# Altium schematic sheet PowerBoard.SchDoc
size A2
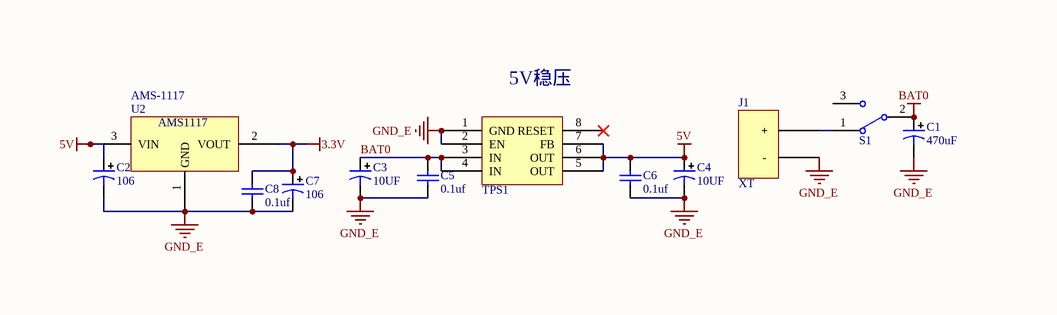
[diagram p0: PowerBoard.SchDoc, top left]
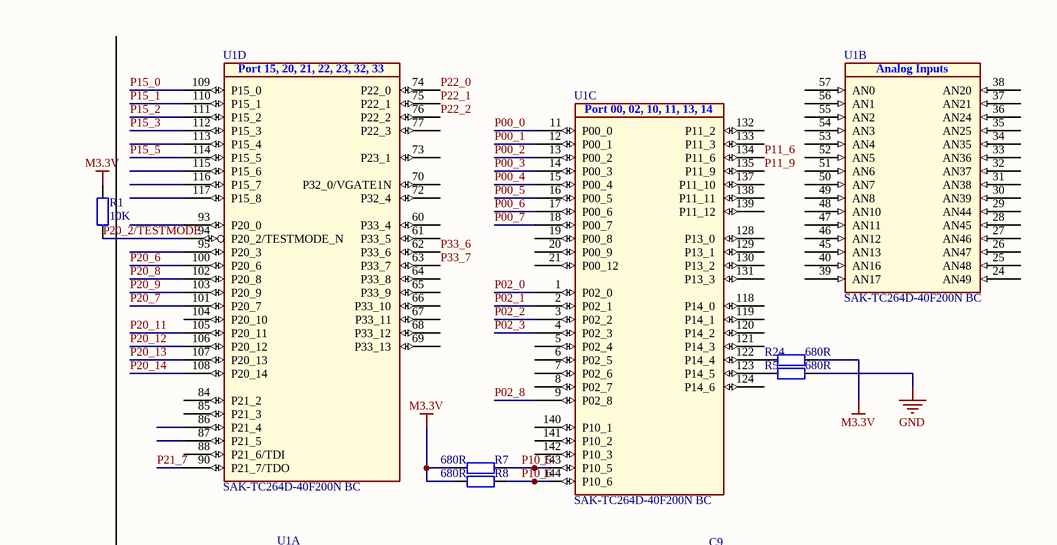
[diagram p1: PowerBoard.SchDoc, top right]
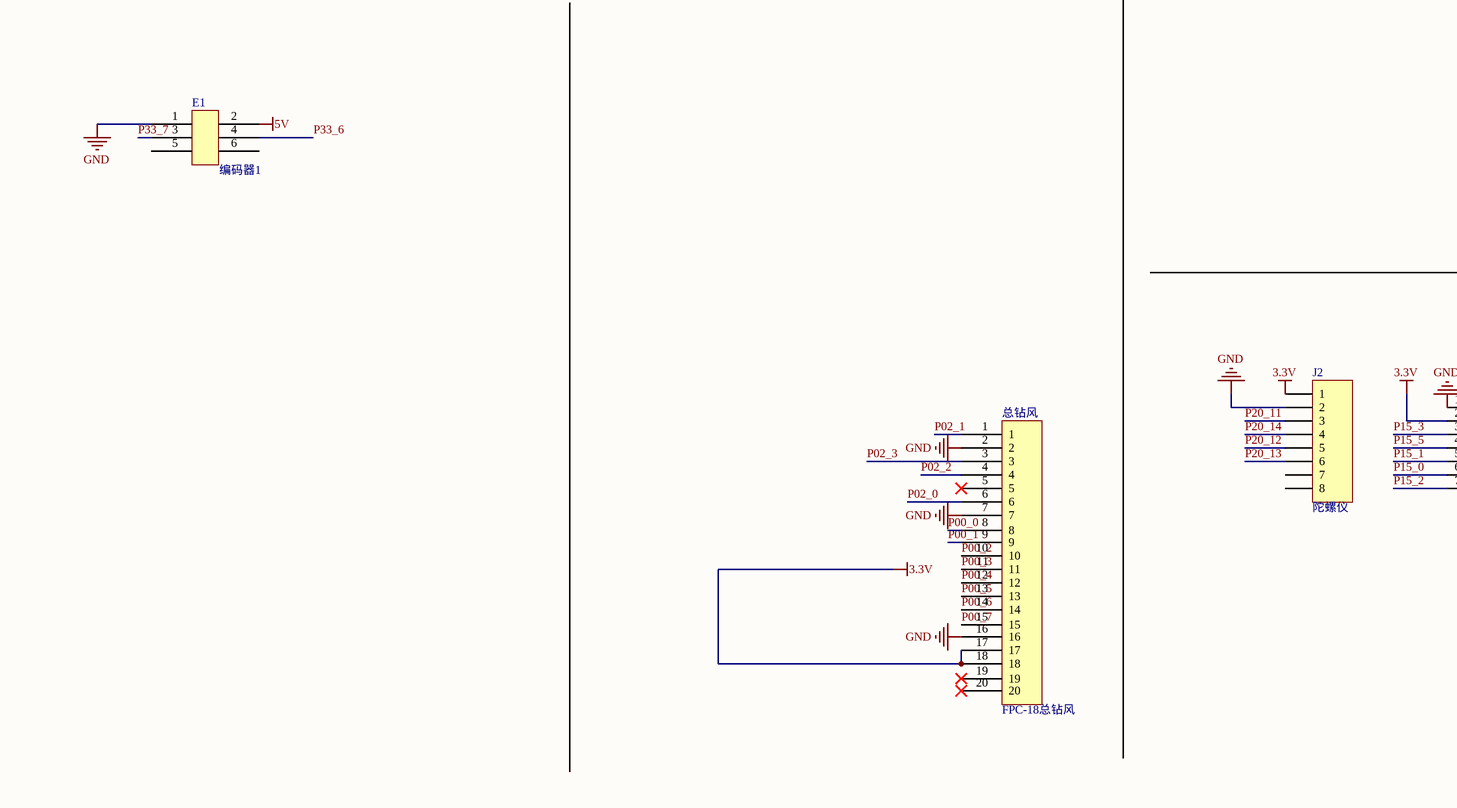
[diagram p2: PowerBoard.SchDoc, bottom left]
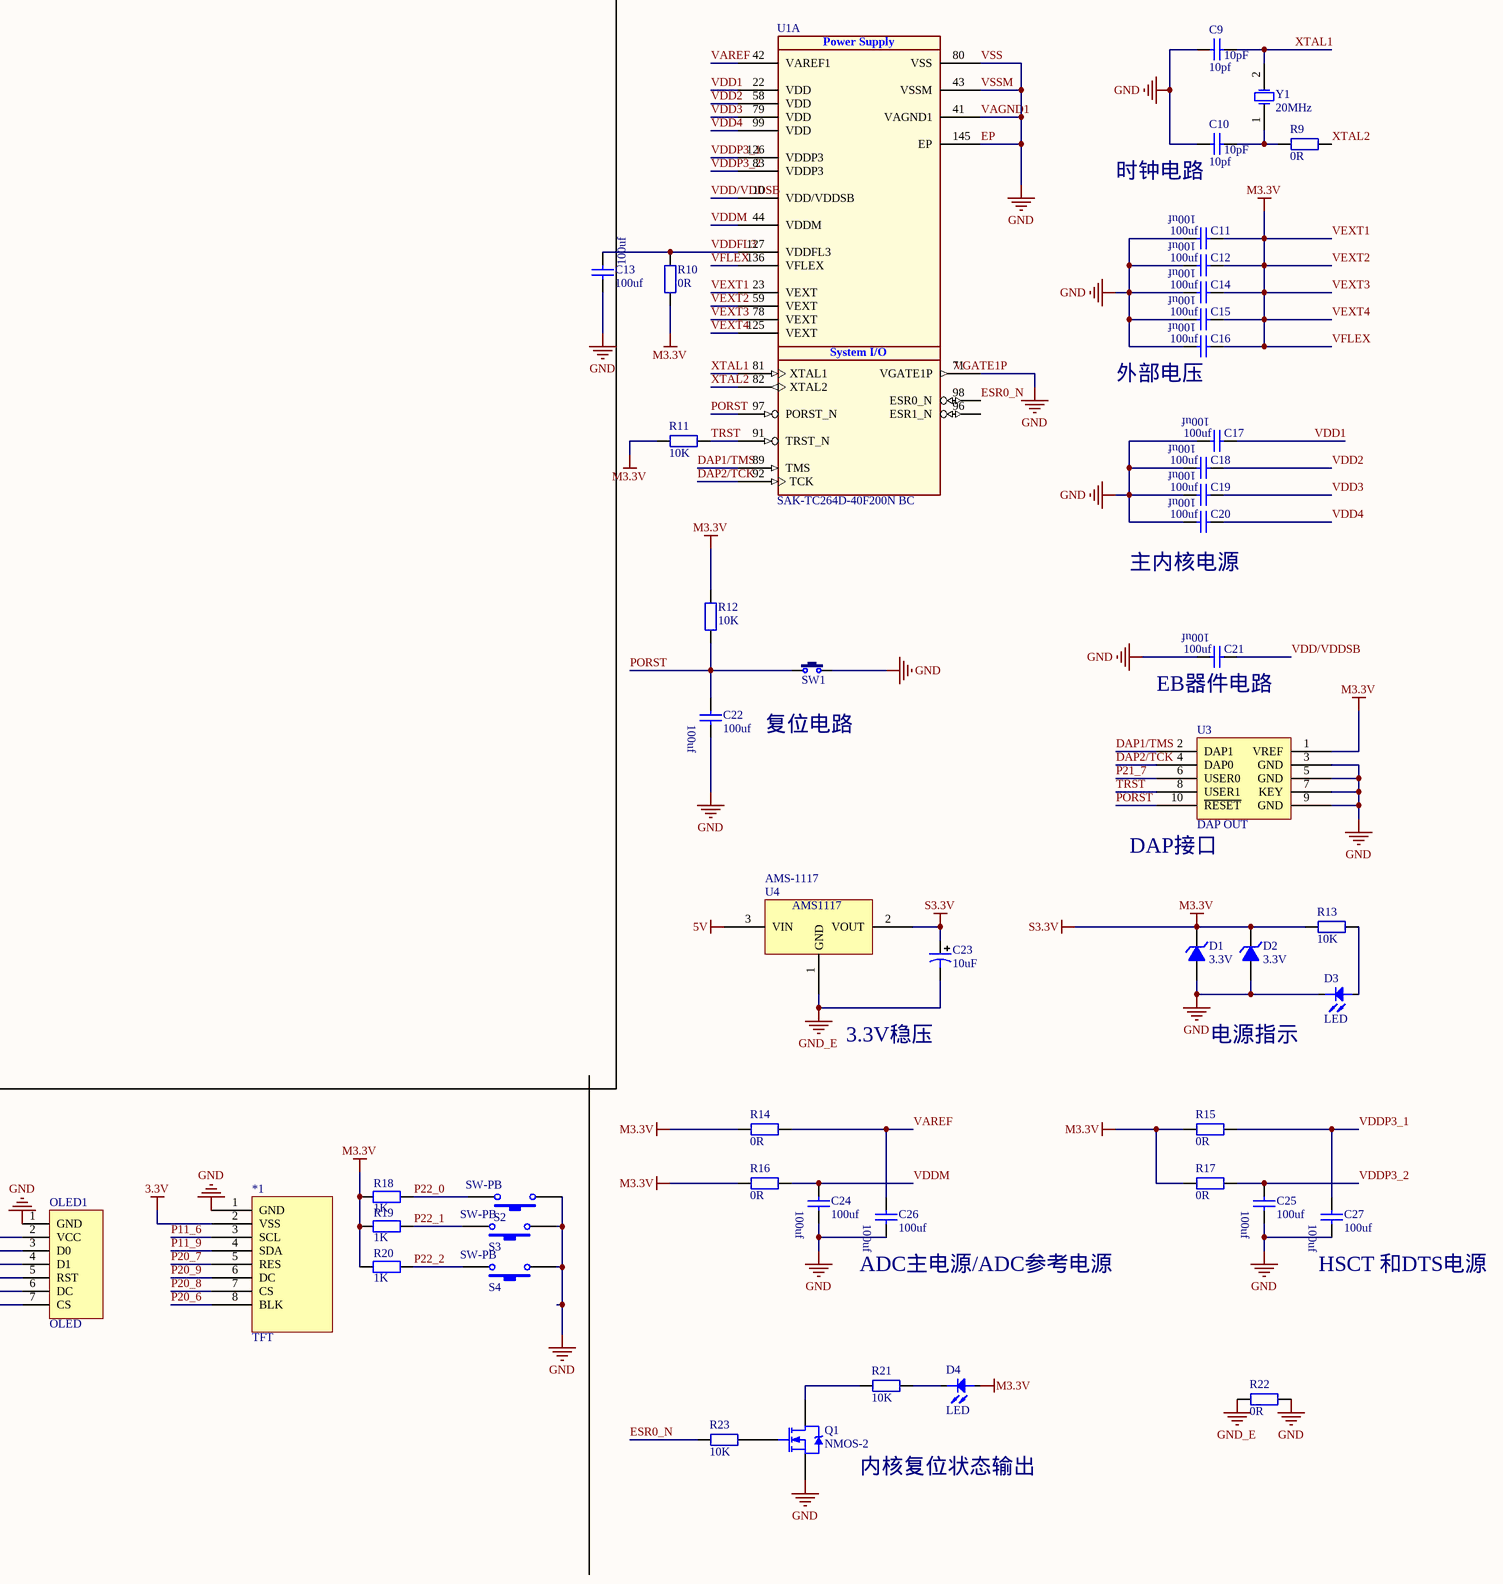
[diagram p3: PowerBoard.SchDoc, bottom right]

## Parts
*1  TFT  [1.8TFT彩屏]
C1  470uf  [CM E(8*10.2)]
C2  value 106  [1206]  (hidden comment: 10uf)
C3  10uf  [1206]
C4  10uf  [1206]
C5  0.1uf  [0805C]
C6  0.1uf  [0805C]
C7  value 106  [1206]  (hidden comment: 10uf)
C8  0.1uf  [0805C]
C9  10pf  [0805C]
C10  10pf  [0805C]
C11  100uf  [0805C]
C12  100uf  [0805C]
C13  100uf  [0805C]
C14  100uf  [0805C]
C15  100uf  [0805C]
C16  100uf  [0805C]
C17  100uf  [0805C]
C18  100uf  [0805C]
C19  100uf  [0805C]
C20  100uf  [0805C]
C21  100uf  [0805C]
C22  100uf  [0805C]
C23  10uf  [CM E(8*10.2)]
C24  100uf  [0805C]
C25  100uf  [0805C]
C26  100uf  [0805C]
C27  100uf  [0805C]
D1  3.3V  [DO-35]
D2  3.3V  [DO-35]
D3  LED  [0805LED]
D4  LED  [0805LED]
E1  编码器1  [IDC-6]
J1  XT  [XT60]
J2  陀螺仪  [HDR1X8]
OLED1  OLED  [SIP7]
Q1  NMOS-2  [SOT23-3]
R1  10K  [0805R]
R5  680R  [0805R]
R7  680R  [0805R]
R8  680R  [0805R]
R9  0R  [0805R]
R10  0R  [0805R]
R11  10K  [0805R]
R12  10K  [0805R]
R13  10K  [0805R]
R14  0R  [0805R]
R15  0R  [0805R]
R16  0R  [0805R]
R17  0R  [0805R]
R18  value 1K  [0805R]  (hidden comment: Res2)
R19  value 1K  [0805R]  (hidden comment: Res2)
R20  value 1K  [0805R]  (hidden comment: Res2)
R21  10K  [0805R]
R22  0R  [0805R]
R23  10K  [0805R]
R24  680R  [0805R]
S1  MTS-10x  [MTS-10x]  (value not drawn)
S2  SW-PB  [TSW SMD-3*6*5]
S3  SW-PB  [TSW SMD-3*6*5]
S4  SW-PB  [TSW SMD-3*6*5]
SW1  6x6x5  [TSW SMD-3*6*5]  (value not drawn)
TPS1  TPS7350  [SO8_L]  (value not drawn)
U1  SAK-TC264D-40F200N BC  [QFP50P2200X2200X160-145N-1]  (parts A,B,C,D of 4)
U2  AMS-1117  [SOT223-AMS1117]
U3  DAP OUT  [IDC10]
U4  AMS-1117  [SOT223-AMS1117]
Y1  20MHz  [OSC 5032-2P]
总钻风  FPC-18总钻风  [FH12-18S-0.5SH]

## Nets
3.3V: *1.2(VSS) C7.1 C8.1 J2.1 OLED1.2(VCC) U2.2(VOUT) 总钻风.17 总钻风.18
5V: C2.1 C4.1 C6.1 E1.2 TPS1.5(OUT) TPS1.6(OUT) TPS1.7(FB) U2.3(VIN) U4.3(VIN)
BAT0: C1.1 C3.1 C5.1 S1.2 TPS1.3(IN) TPS1.4(IN)
EP: *1.1(GND) C9.1 C10.1 C11.2 C12.2 C13.1 C14.2 C15.2 C16.2 C17.2 C18.2 C19.2 C20.2 C21.2 C22.2 C24.2 C25.2 C26.2 C27.2 D1.1(A) D2.1(A) D3.2 E1.1 J2.2 OLED1.1(GND) Q1.3(S) R5.2 R22.2 S2.1 S3.1 S4.1 SW1.2 U1.41(VAGND1) U1.43(VSSM) U1.71(VGATE1P) U1.80(VSS) U1.145(EP) U3.3(GND) U3.5(GND) U3.7(KEY) U3.9(GND) 总钻风.2 总钻风.7 总钻风.16  [also labelled GND, VAGND1, VSS, VSSM]
GND_E: C1.2 C2.2 C3.2 C4.2 C5.2 C6.2 C7.2 C8.2 C23.2 J1.2(－) R22.1 TPS1.1(GND) TPS1.2(EN) U2.1(GND) U4.1(GND)
VEXT1: C11.1 C12.1 C14.1 C15.1 C16.1 C23.1 D1.2(K) D2.2(K) D4.1 R1.2 R7.1 R8.1 R10.1 R11.2 R12.2 R13.2 R14.1 R15.1 R16.1 R17.1 R18.1 R19.1 R20.1 R24.2 U1.23(VEXT) U1.59(VEXT) U1.78(VEXT) U1.125(VEXT) U1.136(VFLEX) U3.1(VREF) U4.2(VOUT)  [also labelled M3.3V, S3.3V, VEXT2, VEXT3, VEXT4, VFLEX]
DAP1/TMS: U1.89(TMS) U3.2(DAP1)
DAP2/TCK: U1.92(TCK) U3.4(DAP0)
ESR0_N: R23.2 U1.98(ESR0_N)
P00_0: U1.11(P00_0) 总钻风.8
P00_1: U1.12(P00_1) 总钻风.9
P00_2: U1.13(P00_2) 总钻风.10
P00_3: U1.14(P00_3) 总钻风.11
P00_4: U1.15(P00_4) 总钻风.12
P00_5: U1.16(P00_5) 总钻风.13
P00_6: U1.17(P00_6) 总钻风.14
P00_7: U1.18(P00_7) 总钻风.15
P02_0: U1.1(P02_0) 总钻风.6
P02_1: U1.2(P02_1) 总钻风.1
P02_2: U1.3(P02_2) 总钻风.4
P02_3: U1.4(P02_3) 总钻风.3
P02_8: U1.9(P02_8)
P10_5: R7.2 U1.143(P10_5)
P10_6: R8.2 U1.144(P10_6)
P11_6: *1.3(SCL) U1.134(P11_6)
P11_9: *1.4(SDA) U1.135(P11_9)
P15_0: OLED1.6(DC) U1.109(P15_0)
P15_1: OLED1.5(RST) U1.110(P15_1)
P15_2: OLED1.7(CS) U1.111(P15_2)
P15_3: OLED1.3(D0) U1.112(P15_3)
P15_5: OLED1.4(D1) U1.114(P15_5)
P20_2/TESTMODE: R1.1 U1.94(P20_2/TESTMODE_N)
P20_6: *1.8(BLK) U1.100(P20_6)
P20_7: *1.5(RES) U1.101(P20_7)
P20_8: *1.7(CS) U1.102(P20_8)
P20_9: *1.6(DC) U1.103(P20_9)
P20_11: J2.3 U1.105(P20_11)
P20_12: J2.5 U1.106(P20_12)
P20_13: J2.6 U1.107(P20_13)
P20_14: J2.4 U1.108(P20_14)
P21_7: U1.90(P21_7/TDO) U3.6(USER0)
P22_0: R18.2 S2.2 U1.74(P22_0)
P22_1: R19.2 S3.2 U1.75(P22_1)
P22_2: R20.2 S4.2 U1.76(P22_2)
P33_6: E1.4 U1.62(P33_6)
P33_7: E1.3 U1.63(P33_7)
PORST: C22.1 R12.1 SW1.1 U1.97(PORST_N) U3.10(~{RESET})
TRST: R11.1 U1.91(TRST_N) U3.8(USER1)
VAREF: C26.1 R14.2 U1.42(VAREF1)
VDD1: C17.1 U1.22(VDD)
VDD2: C18.1 U1.58(VDD)
VDD3: C19.1 U1.79(VDD)
VDD4: C20.1 U1.99(VDD)
VDD/VDDSB: C21.1 U1.10(VDD/VDDSB)
VDDFL3: C13.2 R10.2 U1.127(VDDFL3)
VDDM: C24.1 R16.2 U1.44(VDDM)
VDDP3_1: C27.1 R15.2 U1.126(VDDP3)
VDDP3_2: C25.1 R17.2 U1.83(VDDP3)
XTAL1: C9.2 U1.81(XTAL1) Y1.2(OSC2)
XTAL2: R9.2 U1.82(XTAL2)
NetC10_2: C10.2 R9.1 Y1.1(OSC1)
NetD3_1: D3.1 R13.1
NetD4_2: D4.2 R21.1
NetJ1_1: J1.1(＋) S1.1
NetQ1_1: Q1.1(G) R23.1
NetQ1_2: Q1.2(D) R21.2
NetR5_1: R5.1 U1.123(P14_5)
NetR24_1: R24.1 U1.122(P14_4)

Not connected (* = marked no-connect by the designer): E1 5 6; J2 7 8; S1 3; TPS1 8(RESET)*; U1 5(P02_4) 6(P02_5) 7(P02_6) 8(P02_7) 19(P00_8) 20(P00_9) 21(P00_12) 24(AN49) 25(AN48) 26(AN47) 27(AN46) 28(AN45) 29(AN44) 30(AN39) 31(AN38) 32(AN37) 33(AN36) 34(AN35) 35(AN25) 36(AN24) 37(AN21) 38(AN20) 39(AN17) 40(AN16) 45(AN13) 46(AN12) 47(AN11) 48(AN10) 49(AN8) 50(AN7) 51(AN6) 52(AN5) 53(AN4) 54(AN3) 55(AN2) 56(AN1) 57(AN0) 60(P33_4) 61(P33_5) 64(P33_8) 65(P33_9) 66(P33_10) 67(P33_11) 68(P33_12) 69(P33_13) 70(P32_0/VGATE1N) 72(P32_4) 73(P23_1) 77(P22_3) 84(P21_2) 85(P21_3) 86(P21_4) 87(P21_5) 88(P21_6/TDI) 93(P20_0) 95(P20_3) 96(ESR1_N) 104(P20_10) 113(P15_4) 115(P15_6) 116(P15_7) 117(P15_8) 118(P14_0) 119(P14_1) 120(P14_2) 121(P14_3) 124(P14_6) 128(P13_0) 129(P13_1) 130(P13_2) 131(P13_3) 132(P11_2) 133(P11_3) 137(P11_10) 138(P11_11) 139(P11_12) 140(P10_1) 141(P10_2) 142(P10_3); 总钻风 5* 19* 20*

## Notes on the sheet
- (near TPS1) 5V稳压
- 时钟电路
- 外部电压
- (near C20) 主内核电源
- (near C21) EB器件电路
- 复位电路
- (near U3) DAP接口
- 3.3V稳压
- 电源指示
- (near C26) ADC主电源/ADC参考电源
- (near C27) HSCT 和DTS电源
- 内核复位状态输出
- Labels drawn without touching a wire or pin: VGATE1P
- Title
- Size:
- Date:
- File:
- A2
- Number:
- Time:
- Revision:
- Sheet
- of
- (in symbol AMS-1117) AMS1117
- (in symbol Cap_1) 10pF
- (in symbol SAK-TC264D-40F200N BC, part A) Power Supply; System I/O
- (in symbol SAK-TC264D-40F200N BC, part B) Analog Inputs
- (in symbol SAK-TC264D-40F200N BC, part C) Port 00, 02, 10, 11, 13, 14
- (in symbol SAK-TC264D-40F200N BC, part D) Port 15, 20, 21, 22, 23, 32, 33

## Library data of the parts
C1-C4 C7 = Cap2: Capacitor; Published: 23-Sep-2002; PackageReference: CAPR5-4X5; Publisher: Altium Limited
  C1: Value: 470uF
  C3 C4: Value: 10UF
C5 C6 C8 = Cap1: Capacitor; Published: 8-Jun-2000; LatestRevisionDate: 17-Jul-2002; LatestRevisionNote: Re-released for DXP Platform.; PackageReference: RAD-0.3; Publisher: Altium Limited; Value: 0.1uf
C9 C10 = Cap_1: Capacitor; Value: 0.01uF; Published: 8-Jun-2000; LatestRevisionDate: 17-Jul-2002; LatestRevisionNote: Re-released for DXP Platform.; PackageReference: RAD-0.3; Publisher: Altium Limited; PackageDescription: Radial Cap, Thru-Hole; 2 Leads; 0.3 in Pin Spacing
C11-C22 C24-C27 = Cap: Capacitor; Value: 0.01uF; Published: 8-Jun-2000; LatestRevisionDate: 17-Jul-2002; LatestRevisionNote: Re-released for DXP Platform.; PackageReference: RAD-0.3; Publisher: Altium Limited; PackageDescription: Radial Cap, Thru-Hole; 2 Leads; 0.3 in Pin Spacing
C23 = Cap2_1: Capacitor; Published: 23-Sep-2002; PackageReference: CAPR5-4X5; Publisher: Altium Limited; Value: 10uF
D1 D2 = DIODE: BOM名称: 3V/0.5W稳压管; 版权归属: 源创客; 学习资源: www.ooocke.com
E1 = DIP6
J2 = Header 8: Header, 8-Pin; LatestRevisionDate: 17-Jul-2002; LatestRevisionNote: Re-released for DXP Platform.; Publisher: Altium Limited
OLED1 = OLED 1.3-12864_7pin: BOM名称: 12864 点阵屏; 版权归属: 源创客; 学习资源: www.ooocke.com
Q1 = NMOS-2: N-Channel Power MOSFET; Note: Pin 2 is electrically connected to pin 4.; Published: 8-Jun-2000; LatestRevisionDate: 17-Jul-2002; LatestRevisionNote: Re-released for DXP Platform.; DatasheetVersion: PD-9.814; PackageVersion: Feb-1997; PackageReference: TO-220AB; Publisher: Altium Limited; PackageDescription: TO, Thru-Hole, Vertical, Heatsink Mounted; 3 In-Line Leads; Pitch 2.54 mm; ComponentLink1Description: Manufacturer Link; ComponentLink1URL: http://www.irf.com/
R1 R11-R13 R21 R23 = RES_3
R5 R7 R8 R24 = RES
R9 R10 R14-R17 R22 = RES_2
R18-R20 = Res2: Resistor; Published: 8-Jun-2000; LatestRevisionDate: 17-Jul-2002; LatestRevisionNote: Re-released for DXP Platform.; PackageReference: AXIAL-0.4; Publisher: Altium Limited
S1 = MTS-10x: MTS10x系列3脚扭子开关; 版权归属: 源创客; BOM名称: MTS10x系列3脚扭子开关; 学习资源: www.ooocke.com
S2-S4 = SW-PB: Switch; Published: 24-Mar-1999; LatestRevisionDate: 17-Jul-2002; LatestRevisionNote: Re-released for DXP Platform.; PackageReference: SPST-2; Publisher: Altium Limited; PackageDescription: Switch; 2 Leads
SW1 = TSW DIP-6x6_V: 侧按直插6x6轻触开关; 版权归属: 源创客; BOM名称: 直插6x6轻触开关; 学习资源: www.ooocke.com
TPS1 = T
U1 = SAK-TC264D-40F200N BC: 32-Bit Single-Chip Microcontroller BC-Step; Manufacturer: Infineon Technologies; PackageReference: PG-LQFP-144-22; ManufacturerPartNumber: SAK-TC264D-40F200N BC
U2 U4 = AMS-1117: 1A low dropout viltage regulator
Y1 = XTAL: Crystal Oscillator; Published: 8-Jun-2000; LatestRevisionDate: 17-Jul-2002; LatestRevisionNote: Re-released for DXP Platform.; PackageReference: R38; Publisher: Altium Limited; PackageDescription: Crystal, Thru-Hole; 2 Leads; Body 3.1 x 8.2 mm (Dia.xH)